# Altium project Sidekick Carrier - Rev. 1.PrjPcb (part 6 of 6)

## Sheet 15 USB.SchDoc
size B; DocumentNumber: 15; SheetNumber: 15; SheetTotal: 17
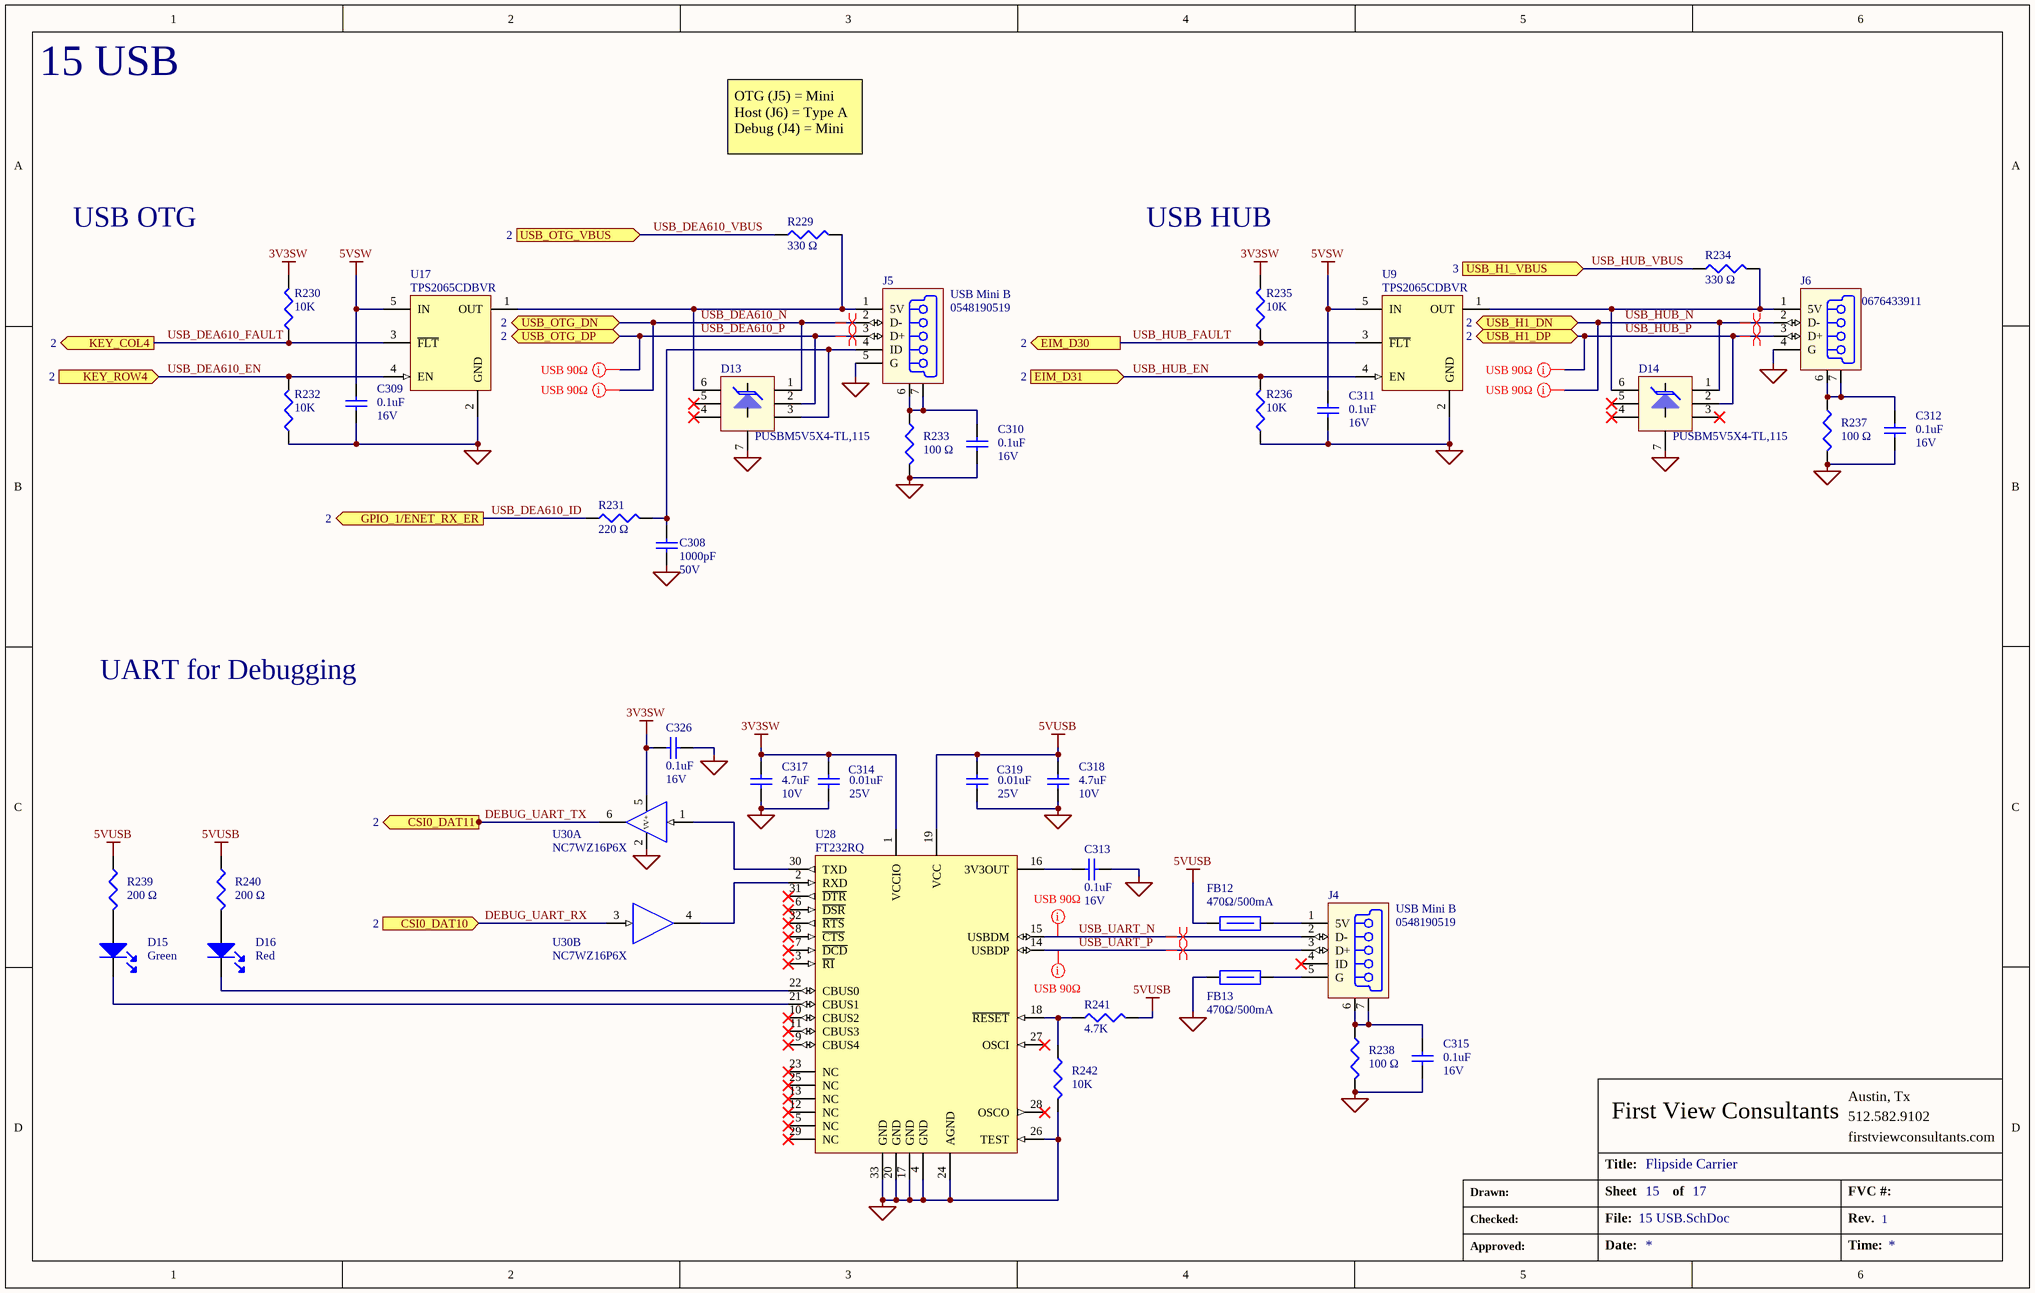
[diagram p14: 15 USB.SchDoc]

### Parts
C308  value 1000pF  Voltage: 50V  [CAP_0402]  (hidden comment: Cap 1000pF 50V 0402)
C309  value 0.1uF  Voltage: 16V  [CAP_0402]  (hidden comment: Cap 0.1uF 16V 0402)
C310  value 0.1uF  Voltage: 16V  [CAP_0402]  (hidden comment: Cap 0.1uF 16V 0402)
C311  value 0.1uF  Voltage: 16V  [CAP_0402]  (hidden comment: Cap 0.1uF 16V 0402)
C312  value 0.1uF  Voltage: 16V  [CAP_0402]  (hidden comment: Cap 0.1uF 16V 0402)
C313  value 0.1uF  Voltage: 16V  [CAP_0402]  (hidden comment: Cap 0.1uF 16V 0402)
C314  value 0.01uF  Voltage: 25V  [CAP_0402]  (hidden comment: Cap 0.01uF 50V 0402)
C315  value 0.1uF  Voltage: 16V  [CAP_0402]  (hidden comment: Cap 0.1uF 16V 0402)
C317  value 4.7uF  Voltage: 10V  [CAP_0402]  (hidden comment: Cap 4.7uF 10V 0603)
C318  value 4.7uF  Voltage: 10V  [CAP_0402]  (hidden comment: Cap 4.7uF 10V 0603)
C319  value 0.01uF  Voltage: 25V  [CAP_0402]  (hidden comment: Cap 0.01uF 50V 0402)
C326  value 0.1uF  Voltage: 16V  [CAP_0402]  (hidden comment: Cap 0.1uF 16V 0402)
D13  PUSBM5V5X4-TL,115  [DFN_PUSBM5V5X4-TL,115]
D14  PUSBM5V5X4-TL,115  [DFN_PUSBM5V5X4-TL,115]
D15  value Green  [LED_0603]  (hidden comment: LG L29K-G2J1-24-Z)
D16  value Red  [LED_0603]  (hidden comment: LTST-C191KRKT)
FB12  value 470Ω/500mA  [IND_0603]  (hidden comment: BLM18EG471SN1D)
FB13  value 470Ω/500mA  [IND_0603]  (hidden comment: BLM18EG471SN1D)
J4  0548190519  value USB Mini B  [CON_USB_0548190519]
J5  0548190519  value USB Mini B  [CON_USB_0548190519]
J6  0676433911  [CON_USB-0676433911]
R229  value 330 Ω  [RES_0402]  (hidden comment: Res 330R 0.063W)
R230  value 10K  [RES_0402]  (hidden comment: Res 10K 0.063W)
R231  value 220 Ω  [RES_0402]  (hidden comment: Res 220R 0.063W)
R232  value 10K  [RES_0402]  (hidden comment: Res 10K 0.063W)
R233  value 100 Ω  [RES_0402]  (hidden comment: Res 100R 0.063W)
R234  value 330 Ω  [RES_0402]  (hidden comment: Res 330R 0.063W)
R235  value 10K  [RES_0402]  (hidden comment: Res 10K 0.063W)
R236  value 10K  [RES_0402]  (hidden comment: Res 10K 0.063W)
R237  value 100 Ω  [RES_0402]  (hidden comment: Res 100R 0.063W)
R238  value 100 Ω  [RES_0402]  (hidden comment: Res 100R 0.063W)
R239  value 200 Ω  [RES_0402]  (hidden comment: Res 200R 0.063W)
R240  value 200 Ω  [RES_0402]  (hidden comment: Res 200R 0.063W)
R241  value 4.7K  [RES_0402]  (hidden comment: Res 4.7K 0.063W)
R242  value 10K  [RES_0402]  (hidden comment: Res 10K 0.063W)
U9  TPS2065CDBVR  [SOT-23-5_TPS2065CDBVR]
U17  TPS2065CDBVR  [SOT-23-5_TPS2065CDBVR]
U28  FT232RQ  [VFQFN-32_FT232RQ]
U30  NC7WZ16P6X  [SOT-363_NC7WZ16P6X]  (parts A,B of 2)

### Ports
CSI0_DAT10 (in, see 2), CSI0_DAT11 (out, see 2), EIM_D30 (out, see 2), EIM_D31 (in, see 2), GPIO_1/ENET_RX_ER (out, see 2), KEY_COL4 (out, see 2), KEY_ROW4 (in, see 2), USB_H1_DN (bidir, see 2), USB_H1_DP (bidir, see 2), USB_H1_VBUS (in, see 3), USB_OTG_DN (bidir, see 2), USB_OTG_DP (bidir, see 2), USB_OTG_VBUS (in, see 2)

### Nets
3V3SW: C314.1 C317.1 C326.1 R230.1 R235.1 U28.1(VCCIO) U30.5(V+)
5VSW: C309.1 C311.1 U9.5(IN) U17.5(IN)
5VUSB: C318.1 C319.1 FB12.1 R239.1 R240.1 R241.2 U28.19(VCC)
GND: C308.2 C309.2 C310.2 C311.2 C312.2 C313.2 C314.2 C315.2 C317.2 C318.2 C319.2 C326.2 D13.7 D14.7 FB13.1 J5.5(G) J6.4(G) R232.2 R233.2 R236.2 R237.2 R238.2 R242.2 U9.2(GND) U17.2(GND) U28.4(GND) U28.17(GND) U28.20(GND) U28.24(AGND) U28.26(TEST) U28.33(GND) U30.2(V-)
DEBUG_UART_RX: U30.3(A2) ; port CSI0_DAT10
DEBUG_UART_TX: U30.6(Y1) ; port CSI0_DAT11
USB_DEA610_EN: R232.1 U17.4(EN) ; port KEY_ROW4
USB_DEA610_FAULT: R230.2 U17.3(~{FLT}) ; port KEY_COL4
USB_DEA610_ID: R231.1 ; port GPIO_1/ENET_RX_ER
USB_DEA610_N: D13.1 J5.2(D-) ; port USB_OTG_DN
USB_DEA610_P: D13.2 J5.3(D+) ; port USB_OTG_DP
USB_DEA610_VBUS: R229.1 ; port USB_OTG_VBUS
USB_HUB_EN: R236.1 U9.4(EN) ; port EIM_D31
USB_HUB_FAULT: R235.2 U9.3(~{FLT}) ; port EIM_D30
USB_HUB_N: D14.1 J6.2(D-) ; port USB_H1_DN
USB_HUB_P: D14.2 J6.3(D+) ; port USB_H1_DP
USB_HUB_VBUS: R234.1 ; port USB_H1_VBUS
USB_UART_N: J4.2(D-) U28.15(USBDM)
USB_UART_P: J4.3(D+) U28.14(USBDP)
NetC308_1: C308.1 D13.3 J5.4(ID) R231.2
NetC310_1: C310.1 J5.6(S1) J5.7(S2) R233.1
NetC312_1: C312.1 J6.6(S1) J6.7(S2) R237.1
NetC313_1: C313.1 U28.16(3V3OUT)
NetC315_1: C315.1 J4.6(S1) J4.7(S2) R238.1
NetD13_6: D13.6 J5.1(5V) R229.2 U17.1(OUT)
NetD14_6: D14.6 J6.1(5V) R234.2 U9.1(OUT)
NetD15_A: D15.A R239.2
NetD15_K: D15.K U28.21(CBUS1)
NetD16_A: D16.A R240.2
NetD16_K: D16.K U28.22(CBUS0)
NetFB12_2: FB12.2 J4.1(5V)
NetFB13_2: FB13.2 J4.5(G)
NetR241_1: R241.1 R242.1 U28.18(~{RESET})
NetU28_2: U28.2(RXD) U30.4(Y2)
NetU28_30: U28.30(TXD) U30.1(A1)

Not connected (* = marked no-connect by the designer): D13 4* 5*; D14 3* 4* 5*; J4 4(ID)*; U28 3(~{RI})* 5(NC)* 6(~{DSR})* 7(~{DCD})* 8(~{CTS})* 9(CBUS4)* 10(CBUS2)* 11(CBUS3)* 12(NC)* 13(NC)* 23(NC)* 25(NC)* 27(OSCI)* 28(OSCO)* 29(NC)* 31(~{DTR})* 32(~{RTS})*

### Layout directives
net class USB 90ohm; Impedance: 90 Ω: USB_DEA610_N, USB_DEA610_P, USB_HUB_N, USB_HUB_P, USB_UART_N, USB_UART_P
differential pair: USB_DEA610_N, USB_DEA610_P, USB_HUB_N, USB_HUB_P, USB_UART_N, USB_UART_P

### Notes on the sheet
- 15 USB
- OTG (J5) = Mini
  Host (J6) = Type A
  Debug (J4) = Mini
- USB OTG
- USB HUB
- UART for Debugging
- Austin, Tx
- Title:
- First View Consultants
- 512.582.9102
- firstviewconsultants.com
- Drawn:
- Checked:
- File:
- Sheet
- of
- FVC #:
- Rev.
- Approved:
- Date:
- Time:

### Library data of the parts
C308 = Cap 1000pF 50V 0402: Cap, Cer, 1000pF, 50V, 20%, X7R, 0402; Manufacturer: Murata Electronics North America; Manufacturer #: GRM155R71H102KA01D; Have Footprint: yes; Tolerance: 20%; PACKAGE: 0402
C309-C313 C315 C326 = Cap 0.1uF 16V 0402: Cap, Cer, 0.1uF, 16V, 10%, X7R, 0402; Manufacturer #: GRM155R71C104KA88D; Manufacturer: Murata Electronics North America; Have Footprint: yes; Package: 0402; Tolerance: ±10%
C314 C319 = Cap 0.01uF 50V 0402: Cap, Cer, 0.01uF, 25V, ±10%, X7R, 0402; Manufacturer #: GRM155R71E103KA01J; Manufacturer: Murata; Have Footprint: yes; Tolerance: ±10%; Package: 0402
C317 C318 = Cap 4.7uF 10V 0603: Cap, Cer, 4.7uF, 10V, 10%, X5R, 0603; Manufacturer #: LMK107BJ475KA-T; Manufacturer: Taiyo Yuden; Have Footprint: yes; Tolerance: ±10%; Package: 0402
D13 D14 = PUSBM5V5X4-TL,115: Diode, TVS, USB 2.0 & OTG, DFN-6; Manufacturer: NXP Semiconductors; Package: DFN (1.6x1.6); Manufacturer #: PUSBM5V5X4-TL,115
D15 = LG L29K-G2J1-24-Z: Led, Green, 2mA, 1.7V, 0603; Manufacturer: OSRAM Opto Semiconductors Inc; Have Footprint: yes; RoHS: yes; Operating Temperature: -40°C ~ 125°C; Package: 0603; Manufacturer #: LG L29K-G2J1-24-Z
D16 = LTST-C191KRKT: Led, Red, 20mA, 2V, 0603; Manufacturer: Lite-On Inc; Have Footprint: yes; RoHS: yes; Package: 0603; Manufacturer #: LTST-C191KRKT
FB12 FB13 = BLM18EG471SN1D: Ind, Ferrite Bead, 470R, 210mOhm, 0.5A, 0603; Manufacturer: Murata Electronics North America; Have Footprint: yes; Manufacturer #: BLM18EG471SN1D; Cost: 0.23; Package: 0603
J4 J5 = 0548190519: Conn, USB, Mini B, 5 Pos, R/A, TH; Manufacturer: Molex Inc; Manufacturer #: 0548190519
J6 = 0676433911: Conn, USB, Type A, 4 Pos, R/A, TH; Manufacturer: Molex Inc; Manufacturer #: 0676433911
R229 R234 = Res 330R 0.063W: Res, 330R, 0.063W, 1%, 0402; Manufacturer #: RC0402FR-07330RL; Manufacturer: Yageo; Have Footprint: yes; Package: 0402; Cost: *
R230 R232 R235 R236 R242 = Res 10K 0.063W: Res, 10K, 1/16W, 1%, 0402; Manufacturer #: RC0402FR-0710KL; Manufacturer: Yageo; Have Footprint: yes; Package: 0402
R231 = Res 220R 0.063W: Res, 220R, 0.063W, 5%, 0402; Manufacturer #: RMCF0402JT220R; Manufacturer: Stackpole Electronics Inc; Have Footprint: yes; Package: 0402
R233 R237 R238 = Res 100R 0.063W: Res, 100R, 0.063W, 1%, 0402; Manufacturer #: TRR01MZPF1000; Manufacturer: Murata Electronics North America; Have Footprint: yes; Package: 0402
R239 R240 = Res 200R 0.063W: Res, 200R, 0.063W, 1%, 0402; Manufacturer #: RC0402FR-07200RL; Manufacturer: Yageo; Have Footprint: yes; Package: 0402
R241 = Res 4.7K 0.063W: Res, 4.70K, 0.063W, 1%, 0402; Manufacturer #: CRCW04024K70FKED; Manufacturer: Vishay Dale; Have Footprint: yes; Package: 0402
U9 U17 = TPS2065CDBVR: IC, Power Switch, USB, 1.48A, SOT-23-5; Manufacturer: Texas Instruments; θJA: 224.9; Have Footprint: yes; Package: SOT-23-5; Operating Temperature: -40°C ~ 85°C; RoHS: yes; Manufacturer #: TPS2065CDBVR
U28 = FT232RQ: IC, USB to UART, 3.3-5.25V, QFN-32; Manufacturer #: FT232RQ-REEL; Manufacturer: FTDI; Have Footprint: yes
U30 = NC7WZ16P6X: IC, Buffer, 1.65-5.5V, -40+125°C, SOT-363; Manufacturer: Fairchild Semiconductor; Have Footprint: yes; Cost: 0.45; Package: SOT-363; Manufacturer #: NC7WZ16P6X

## Sheet 16 Ethernet.SchDoc
size B; DocumentNumber: 16; SheetNumber: 16; SheetTotal: 17
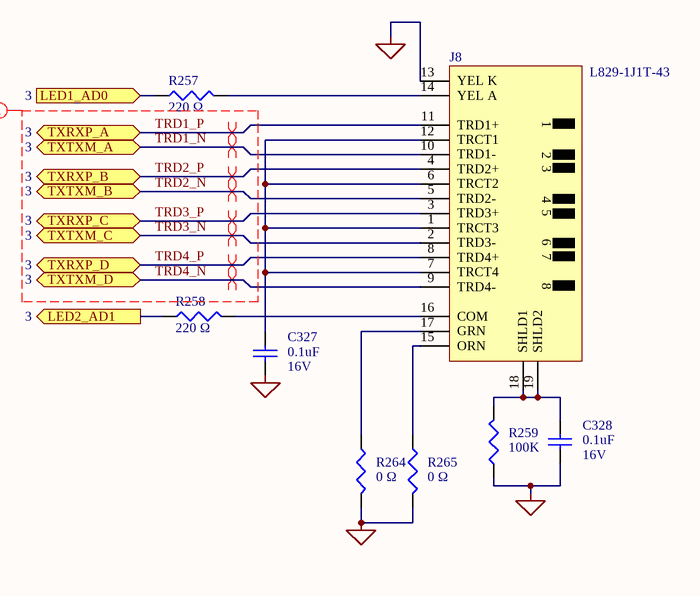
[diagram p15: 16 Ethernet.SchDoc]

### Parts
C327  value 0.1uF  Voltage: 16V  [CAP_0402]  (hidden comment: Cap 0.1uF 16V 0402)
C328  value 0.1uF  Voltage: 16V  [CAP_0402]  (hidden comment: Cap 0.1uF 16V 0402)
J8  L829-1J1T-43  [CON_Ethernet_L829-1J1T-43]
R257  value 220 Ω  [RES_0402]  (hidden comment: Res 220R 0.063W)
R258  value 220 Ω  [RES_0402]  (hidden comment: Res 220R 0.063W)
R259  value 100K  [RES_0402]  (hidden comment: Res 100K 0.1W)
R264  value 0 Ω  [RES_0402]  (hidden comment: Res 0 ohm 0.1W)
R265  value 0 Ω  [RES_0402]  (hidden comment: Res 0 ohm 0.1W)

### Ports
LED1_AD0 (in, see 3), LED2_AD1 (out, see 3), TXRXP_A (bidir, see 3), TXRXP_B (bidir, see 3), TXRXP_C (bidir, see 3), TXRXP_D (bidir, see 3), TXTXM_A (bidir, see 3), TXTXM_B (bidir, see 3), TXTXM_C (bidir, see 3), TXTXM_D (bidir, see 3)

### Nets
GND: C327.2 C328.2 J8.13(YEL_K) R259.1 R264.2 R265.2
TRD1_N: J8.10(TRD1-) ; port TXTXM_A
TRD1_P: J8.11(TRD1+) ; port TXRXP_A
TRD2_N: J8.5(TRD2-) ; port TXTXM_B
TRD2_P: J8.4(TRD2+) ; port TXRXP_B
TRD3_N: J8.2(TRD3-) ; port TXTXM_C
TRD3_P: J8.3(TRD3+) ; port TXRXP_C
TRD4_N: J8.9(TRD4-) ; port TXTXM_D
TRD4_P: J8.8(TRD4+) ; port TXRXP_D
NetC327_1: C327.1 J8.1(TRCT3) J8.6(TRCT2) J8.7(TRCT4) J8.12(TRCT1)
NetC328_1: C328.1 J8.18(SHLD1) J8.19(SHLD2) R259.2
NetJ7_258: R257.1 ; port LED1_AD0
NetJ7_260: R258.1 ; port LED2_AD1
NetJ8_14: J8.14(YEL_A) R257.2
NetJ8_15: J8.15(ORN) R265.1
NetJ8_16: J8.16(COM) R258.2
NetJ8_17: J8.17(GRN) R264.1

### Layout directives
net class ETHERNET 100ohm: TRD1_N, TRD1_P, TRD2_N, TRD2_P, TRD3_N, TRD3_P, TRD4_N, TRD4_P
differential pair: TRD1_N, TRD1_P, TRD2_N, TRD2_P, TRD3_N, TRD3_P, TRD4_N, TRD4_P

### Notes on the sheet
- Austin, Tx
- Title:
- First View Consultants
- 512.582.9102
- firstviewconsultants.com
- Drawn:
- Checked:
- File:
- Sheet
- of
- FVC #:
- Rev.
- Approved:
- Date:
- Time:

### Library data of the parts
C327 C328 = Cap 0.1uF 16V 0402: as C309-C313 on sheet 15 USB; Package: 0402; Tolerance: ±10%
J8 = L829-1J1T-43: Conn, Ethernet, 10/100/1000,G Base-T, TH; Manufacturer: Bel Fuse Inc; Manufacturer #: L829-1J1T-43
R257 R258 = Res 220R 0.063W: as R231 on sheet 15 USB; Package: 0402
R259 = Res 100K 0.1W: Res, 100K, 0.1W, 1%, 0402; Manufacturer #: ERJ-2RKF1003X; Manufacturer: Panasonic Electronic Components; Have Footprint: yes; Package: 0402
R264 R265 = Res 0 ohm 0.1W: Res, 0 ohm, 1/16W, 0402; Manufacturer #: CRCW04020000Z0ED; Manufacturer: Vishay Dale; Have Footprint: yes; Package: 0402

## Sheet 17 USB 3.0.SchDoc
size C; DocumentNumber: 17; SheetNumber: 17; SheetTotal: 17; PageSetup: Record=PageOptions|CenterHorizontal=True|CenterVertical=True|PrintScale=0.70|XCorrection=1.00|YCorrection=1.00|PrintKind=1|BorderSize=5000000|LeftOffset=0|BottomOffset=0|Orientation=2|PaperLength=1000|PaperWidth=1000|Scale=100|PaperSource=7|PrintQuality=600|MediaType=1|DitherType=10|PrintScaleMode=1|PaperKind=11x17|PaperIndex=17
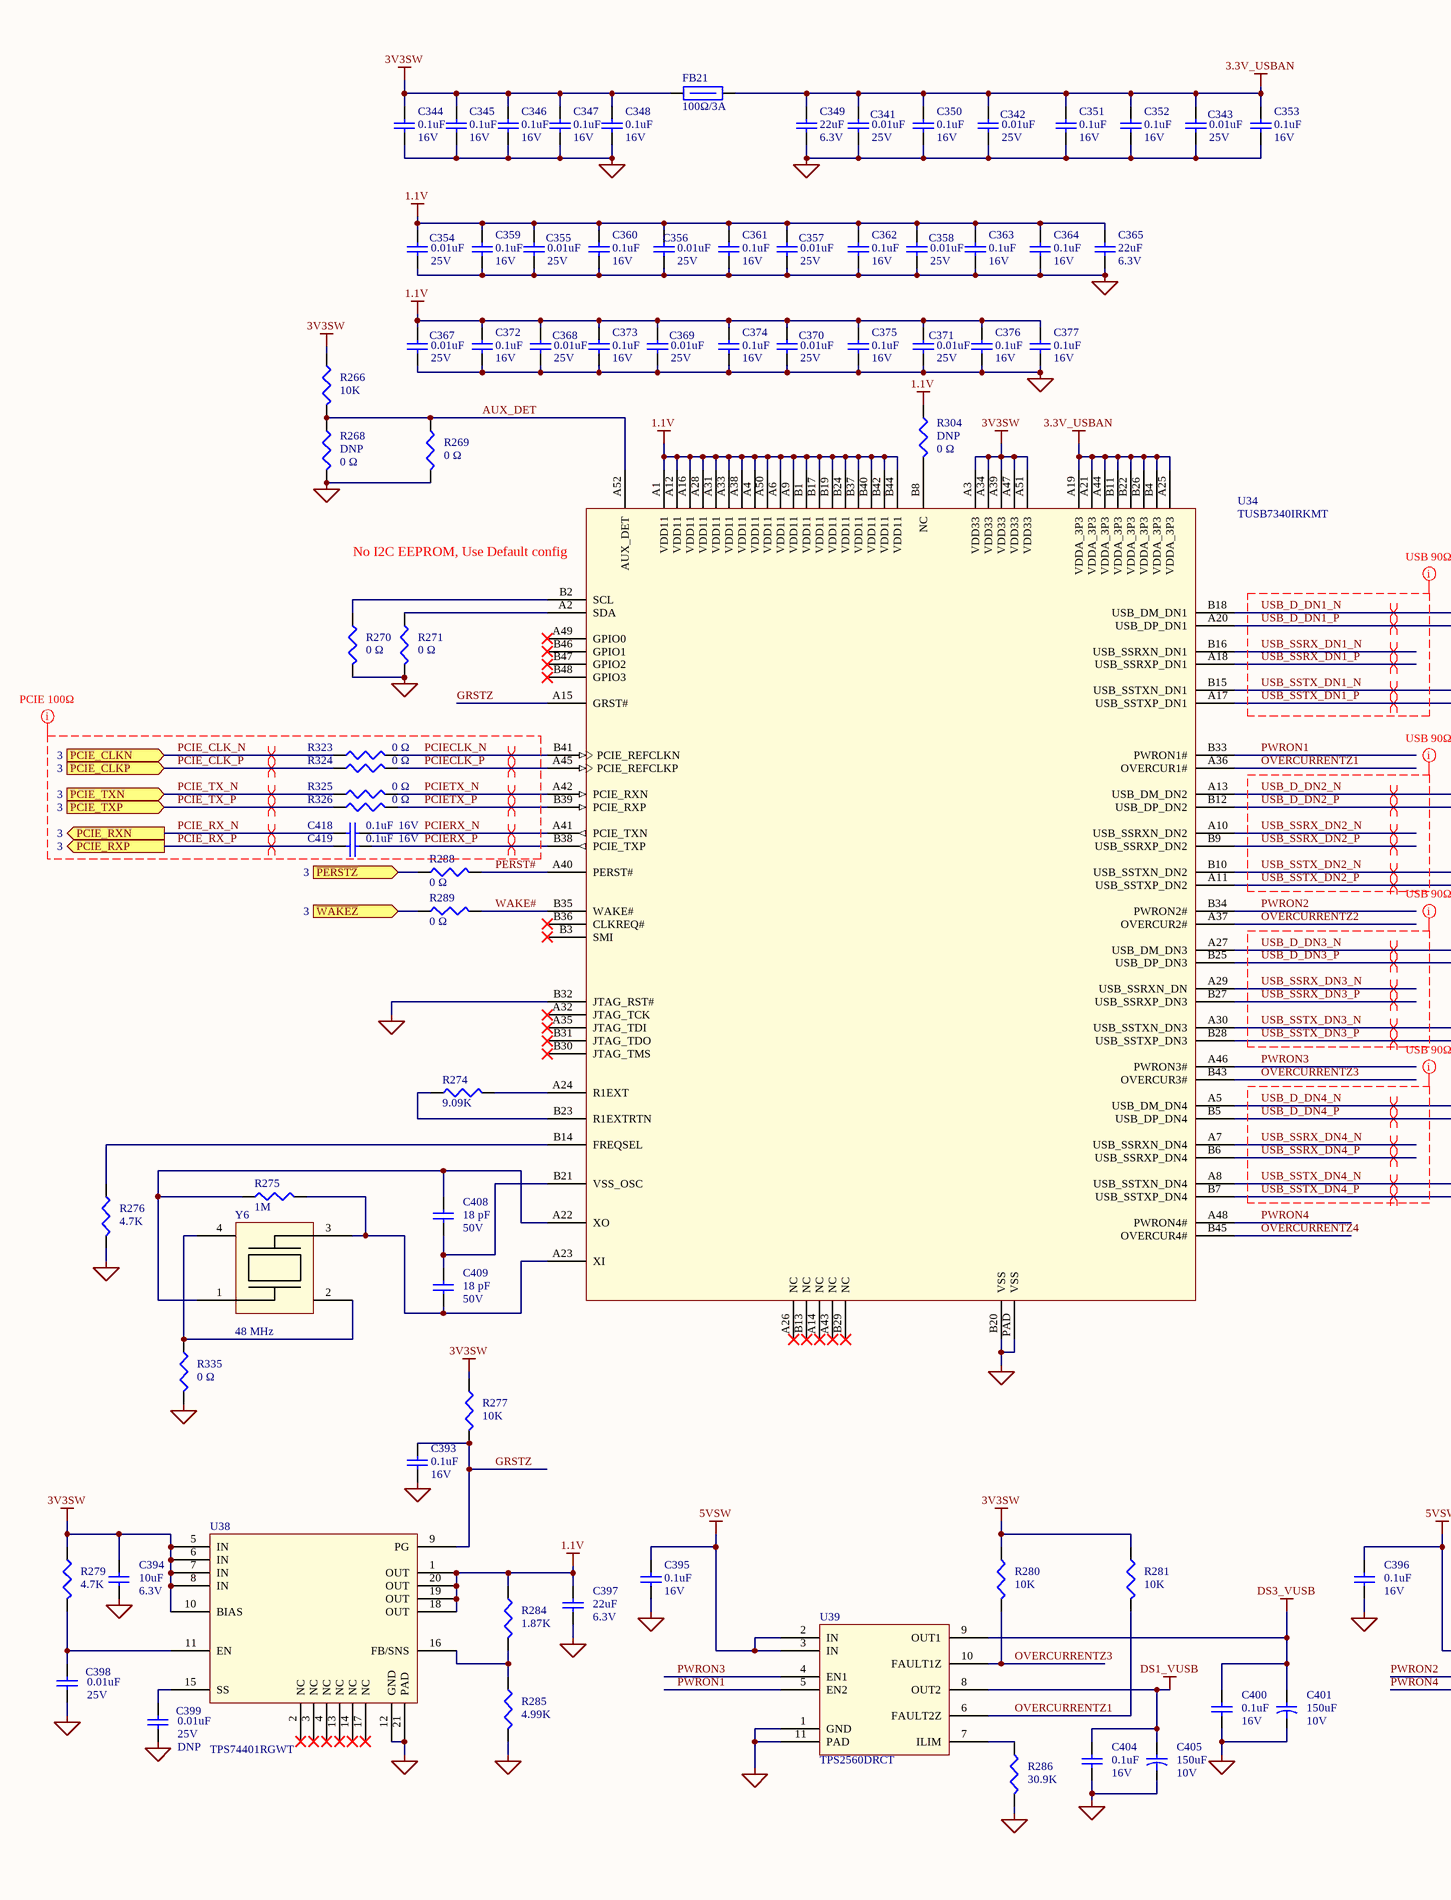
[diagram p16: 17 USB 3.0.SchDoc, left]
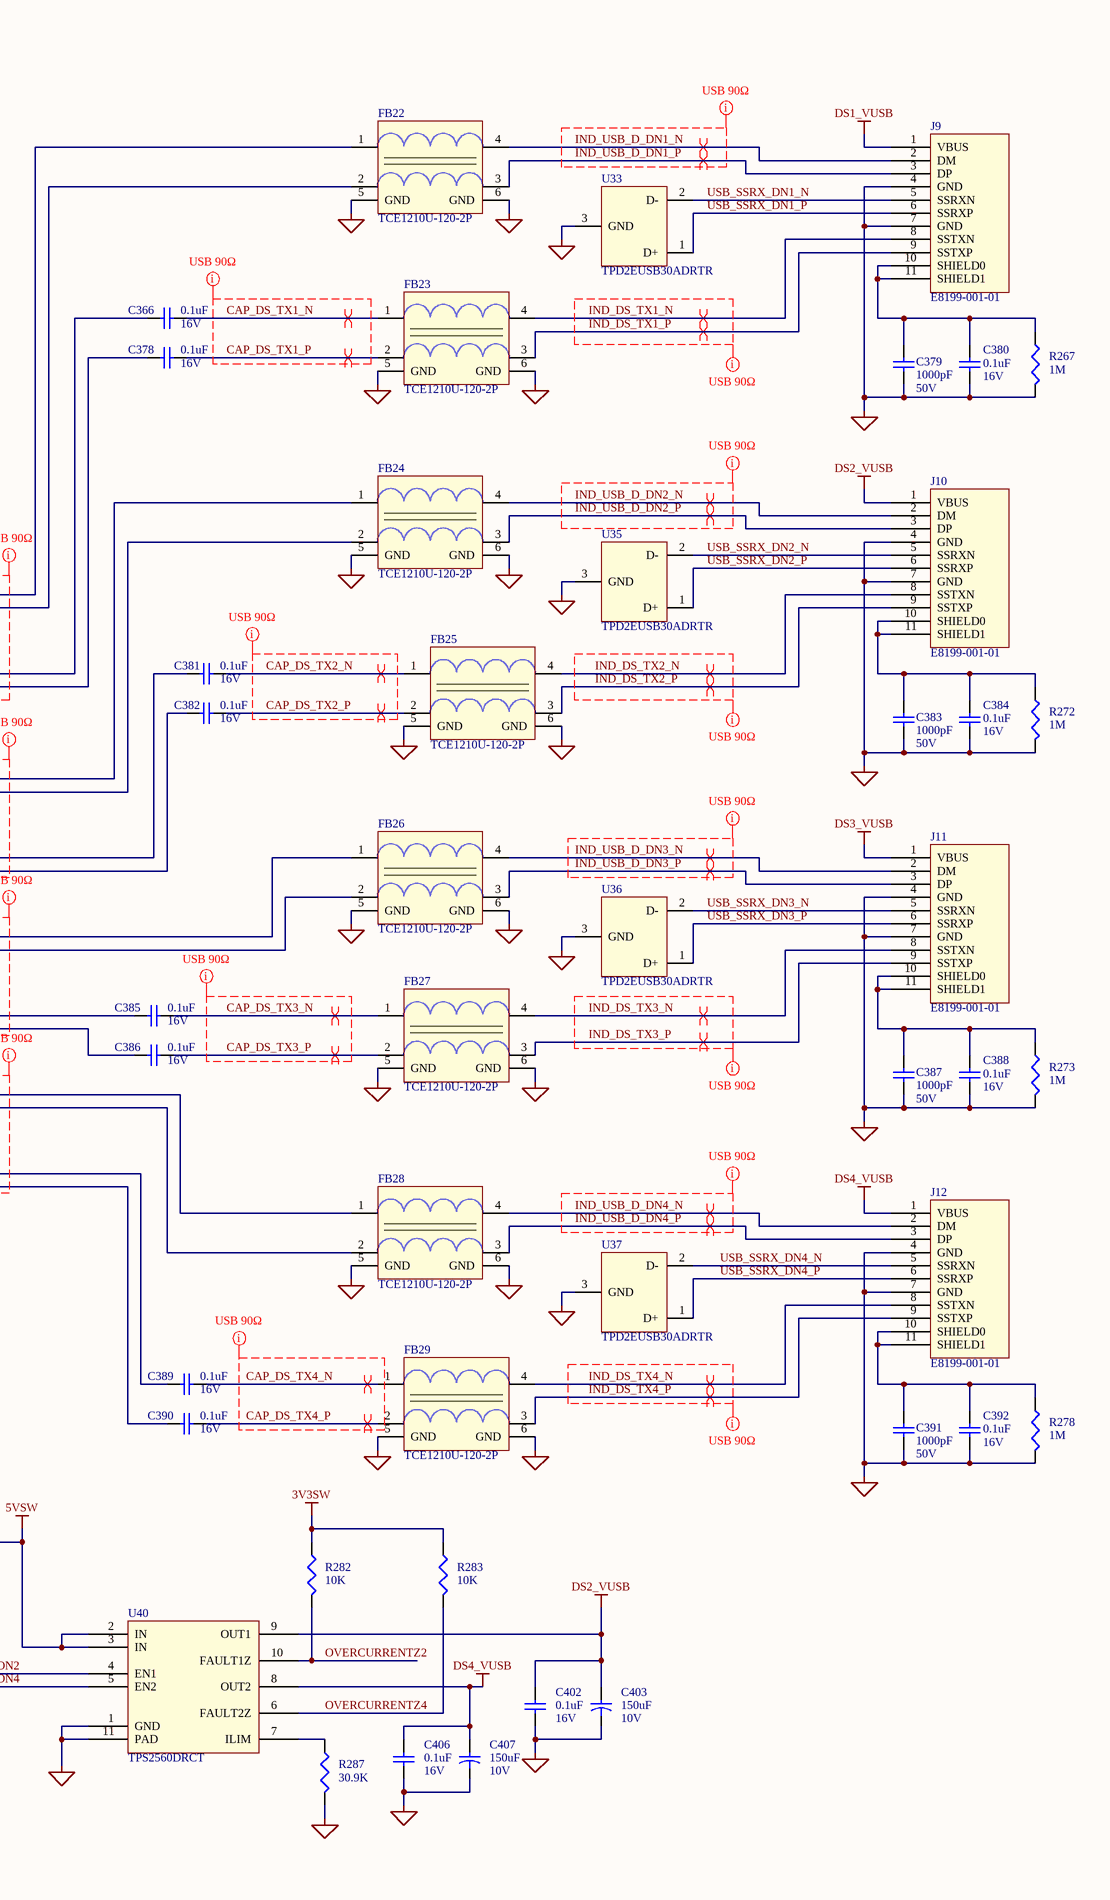
[diagram p17: 17 USB 3.0.SchDoc, right]

### Parts
C341  value 0.01uF  Voltage: 25V  [CAP_0402]  (hidden comment: Cap 0.01uF 50V 0402)
C342  value 0.01uF  Voltage: 25V  [CAP_0402]  (hidden comment: Cap 0.01uF 50V 0402)
C343  value 0.01uF  Voltage: 25V  [CAP_0402]  (hidden comment: Cap 0.01uF 50V 0402)
C344  value 0.1uF  Voltage: 16V  [CAP_0402]  (hidden comment: Cap 0.1uF 16V 0402)
C345  value 0.1uF  Voltage: 16V  [CAP_0402]  (hidden comment: Cap 0.1uF 16V 0402)
C346  value 0.1uF  Voltage: 16V  [CAP_0402]  (hidden comment: Cap 0.1uF 16V 0402)
C347  value 0.1uF  Voltage: 16V  [CAP_0402]  (hidden comment: Cap 0.1uF 16V 0402)
C348  value 0.1uF  Voltage: 16V  [CAP_0402]  (hidden comment: Cap 0.1uF 16V 0402)
C349  value 22uF  Voltage: 6.3V  [CAP_0603]  (hidden comment: Cap 22uF 6.3V 0603)
C350  value 0.1uF  Voltage: 16V  [CAP_0402]  (hidden comment: Cap 0.1uF 16V 0402)
C351  value 0.1uF  Voltage: 16V  [CAP_0402]  (hidden comment: Cap 0.1uF 16V 0402)
C352  value 0.1uF  Voltage: 16V  [CAP_0402]  (hidden comment: Cap 0.1uF 16V 0402)
C353  value 0.1uF  Voltage: 16V  [CAP_0402]  (hidden comment: Cap 0.1uF 16V 0402)
C354  value 0.01uF  Voltage: 25V  [CAP_0402]  (hidden comment: Cap 0.01uF 50V 0402)
C355  value 0.01uF  Voltage: 25V  [CAP_0402]  (hidden comment: Cap 0.01uF 50V 0402)
C356  value 0.01uF  Voltage: 25V  [CAP_0402]  (hidden comment: Cap 0.01uF 50V 0402)
C357  value 0.01uF  Voltage: 25V  [CAP_0402]  (hidden comment: Cap 0.01uF 50V 0402)
C358  value 0.01uF  Voltage: 25V  [CAP_0402]  (hidden comment: Cap 0.01uF 50V 0402)
C359  value 0.1uF  Voltage: 16V  [CAP_0402]  (hidden comment: Cap 0.1uF 16V 0402)
C360  value 0.1uF  Voltage: 16V  [CAP_0402]  (hidden comment: Cap 0.1uF 16V 0402)
C361  value 0.1uF  Voltage: 16V  [CAP_0402]  (hidden comment: Cap 0.1uF 16V 0402)
C362  value 0.1uF  Voltage: 16V  [CAP_0402]  (hidden comment: Cap 0.1uF 16V 0402)
C363  value 0.1uF  Voltage: 16V  [CAP_0402]  (hidden comment: Cap 0.1uF 16V 0402)
C364  value 0.1uF  Voltage: 16V  [CAP_0402]  (hidden comment: Cap 0.1uF 16V 0402)
C365  value 22uF  Voltage: 6.3V  [CAP_0603]  (hidden comment: Cap 22uF 6.3V 0603)
C366  value 0.1uF  Voltage: 16V  [CAP_0402]  (hidden comment: Cap 0.1uF 16V 0402)
C367  value 0.01uF  Voltage: 25V  [CAP_0402]  (hidden comment: Cap 0.01uF 50V 0402)
C368  value 0.01uF  Voltage: 25V  [CAP_0402]  (hidden comment: Cap 0.01uF 50V 0402)
C369  value 0.01uF  Voltage: 25V  [CAP_0402]  (hidden comment: Cap 0.01uF 50V 0402)
C370  value 0.01uF  Voltage: 25V  [CAP_0402]  (hidden comment: Cap 0.01uF 50V 0402)
C371  value 0.01uF  Voltage: 25V  [CAP_0402]  (hidden comment: Cap 0.01uF 50V 0402)
C372  value 0.1uF  Voltage: 16V  [CAP_0402]  (hidden comment: Cap 0.1uF 16V 0402)
C373  value 0.1uF  Voltage: 16V  [CAP_0402]  (hidden comment: Cap 0.1uF 16V 0402)
C374  value 0.1uF  Voltage: 16V  [CAP_0402]  (hidden comment: Cap 0.1uF 16V 0402)
C375  value 0.1uF  Voltage: 16V  [CAP_0402]  (hidden comment: Cap 0.1uF 16V 0402)
C376  value 0.1uF  Voltage: 16V  [CAP_0402]  (hidden comment: Cap 0.1uF 16V 0402)
C377  value 0.1uF  Voltage: 16V  [CAP_0402]  (hidden comment: Cap 0.1uF 16V 0402)
C378  value 0.1uF  Voltage: 16V  [CAP_0402]  (hidden comment: Cap 0.1uF 16V 0402)
C379  value 1000pF  Voltage: 50V  [CAP_0402]  (hidden comment: Cap 1000pF 50V 0402)
C380  value 0.1uF  Voltage: 16V  [CAP_0402]  (hidden comment: Cap 0.1uF 16V 0402)
C381  value 0.1uF  Voltage: 16V  [CAP_0402]  (hidden comment: Cap 0.1uF 16V 0402)
C382  value 0.1uF  Voltage: 16V  [CAP_0402]  (hidden comment: Cap 0.1uF 16V 0402)
C383  value 1000pF  Voltage: 50V  [CAP_0402]  (hidden comment: Cap 1000pF 50V 0402)
C384  value 0.1uF  Voltage: 16V  [CAP_0402]  (hidden comment: Cap 0.1uF 16V 0402)
C385  value 0.1uF  Voltage: 16V  [CAP_0402]  (hidden comment: Cap 0.1uF 16V 0402)
C386  value 0.1uF  Voltage: 16V  [CAP_0402]  (hidden comment: Cap 0.1uF 16V 0402)
C387  value 1000pF  Voltage: 50V  [CAP_0402]  (hidden comment: Cap 1000pF 50V 0402)
C388  value 0.1uF  Voltage: 16V  [CAP_0402]  (hidden comment: Cap 0.1uF 16V 0402)
C389  value 0.1uF  Voltage: 16V  [CAP_0402]  (hidden comment: Cap 0.1uF 16V 0402)
C390  value 0.1uF  Voltage: 16V  [CAP_0402]  (hidden comment: Cap 0.1uF 16V 0402)
C391  value 1000pF  Voltage: 50V  [CAP_0402]  (hidden comment: Cap 1000pF 50V 0402)
C392  value 0.1uF  Voltage: 16V  [CAP_0402]  (hidden comment: Cap 0.1uF 16V 0402)
C393  value 0.1uF  Voltage: 16V  [CAP_0402]  (hidden comment: Cap 0.1uF 16V 0402)
C394  value 10uF  Voltage: 6.3V  [CAP_0402]  (hidden comment: Cap 10uF 6.3V 0402)
C395  value 0.1uF  Voltage: 16V  [CAP_0402]  (hidden comment: Cap 0.1uF 16V 0402)
C396  value 0.1uF  Voltage: 16V  [CAP_0402]  (hidden comment: Cap 0.1uF 16V 0402)
C397  value 22uF  Voltage: 6.3V  [CAP_0603]  (hidden comment: Cap 22uF 6.3V 0603)
C398  value 0.01uF  Voltage: 25V  [CAP_0402]  (hidden comment: Cap 0.01uF 50V 0402)
C399  value 0.01uF  Voltage: 25V  [CAP_0402]  (hidden comment: Cap 0.01uF 50V 0402)
C400  value 0.1uF  Voltage: 16V  [CAP_0402]  (hidden comment: Cap 0.1uF 16V 0402)
C401  value 150uF  Voltage: 10V  [SMD(6.6x6.6x5.8)_WT1A151MCL1GS]  (hidden comment: Cap 150uF 10V)
C402  value 0.1uF  Voltage: 16V  [CAP_0402]  (hidden comment: Cap 0.1uF 16V 0402)
C403  value 150uF  Voltage: 10V  [SMD(6.6x6.6x5.8)_WT1A151MCL1GS]  (hidden comment: Cap 150uF 10V)
C404  value 0.1uF  Voltage: 16V  [CAP_0402]  (hidden comment: Cap 0.1uF 16V 0402)
C405  value 150uF  Voltage: 10V  [SMD(6.6x6.6x5.8)_WT1A151MCL1GS]  (hidden comment: Cap 150uF 10V)
C406  value 0.1uF  Voltage: 16V  [CAP_0402]  (hidden comment: Cap 0.1uF 16V 0402)
C407  value 150uF  Voltage: 10V  [SMD(6.6x6.6x5.8)_WT1A151MCL1GS]  (hidden comment: Cap 150uF 10V)
C408  value 18 pF  Voltage: 50V  [CAP_0402]  (hidden comment: Cap 18pF 50V 0402)
C409  value 18 pF  Voltage: 50V  [CAP_0402]  (hidden comment: Cap 18pF 50V 0402)
C418  value 0.1uF  Voltage: 16V  [CAP_0402]  (hidden comment: Cap 0.1uF 16V 0402)
C419  value 0.1uF  Voltage: 16V  [CAP_0402]  (hidden comment: Cap 0.1uF 16V 0402)
FB21  value 100Ω/3A  [IND_0603]  (hidden comment: BLM18KG101TN1D)
FB22  TCE1210U-120-2P  [USB_TCE1210U-120-2P]
FB23  TCE1210U-120-2P  [USB_TCE1210U-120-2P]
FB24  TCE1210U-120-2P  [USB_TCE1210U-120-2P]
FB25  TCE1210U-120-2P  [USB_TCE1210U-120-2P]
FB26  TCE1210U-120-2P  [USB_TCE1210U-120-2P]
FB27  TCE1210U-120-2P  [USB_TCE1210U-120-2P]
FB28  TCE1210U-120-2P  [USB_TCE1210U-120-2P]
FB29  TCE1210U-120-2P  [USB_TCE1210U-120-2P]
J9  E8199-001-01  [USB_E8199-001-01]
J10  E8199-001-01  [USB_E8199-001-01]
J11  E8199-001-01  [USB_E8199-001-01]
J12  E8199-001-01  [USB_E8199-001-01]
R266  value 10K  [RES_0402]  (hidden comment: Res 10K 0.063W)
R267  value 1M  [RES_0402]  (hidden comment: Res 1M 0.063W)
R268  value 0 Ω  [RES_0402]  (hidden comment: Res 0 ohm 0.1W DNP)
R269  value 0 Ω  [RES_0402]  (hidden comment: Res 0 ohm 0.1W)
R270  value 0 Ω  [RES_0402]  (hidden comment: Res 0 ohm 0.1W)
R271  value 0 Ω  [RES_0402]  (hidden comment: Res 0 ohm 0.1W)
R272  value 1M  [RES_0402]  (hidden comment: Res 1M 0.063W)
R273  value 1M  [RES_0402]  (hidden comment: Res 1M 0.063W)
R274  value 9.09K  [RES_0402]  (hidden comment: Res 9.09K 0.063W)
R275  value 1M  [RES_0402]  (hidden comment: Res 1M 0.063W)
R276  value 4.7K  [RES_0402]  (hidden comment: Res 4.7K 0.063W)
R277  value 10K  [RES_0402]  (hidden comment: Res 10K 0.063W)
R278  value 1M  [RES_0402]  (hidden comment: Res 1M 0.063W)
R279  value 4.7K  [RES_0402]  (hidden comment: Res 4.7K 0.063W)
R280  value 10K  [RES_0402]  (hidden comment: Res 10K 0.063W)
R281  value 10K  [RES_0402]  (hidden comment: Res 10K 0.063W)
R282  value 10K  [RES_0402]  (hidden comment: Res 10K 0.063W)
R283  value 10K  [RES_0402]  (hidden comment: Res 10K 0.063W)
R284  value 1.87K  [RES_0402]  (hidden comment: Res 1.87K 0.063W)
R285  value 4.99K  [RES_0402]  (hidden comment: Res 4.99K 0.063W)
R286  value 30.9K  [RES_0402]  (hidden comment: Res 30.9K 0.063W)
R287  value 30.9K  [RES_0402]  (hidden comment: Res 30.9K 0.063W)
R288  value 0 Ω  [RES_0402]  (hidden comment: Res 0 ohm 0.1W)
R289  value 0 Ω  [RES_0402]  (hidden comment: Res 0 ohm 0.1W)
R304  value 0 Ω  [RES_0402]  (hidden comment: Res 0 ohm 0.1W DNP)
R323  value 0 Ω  [RES_0402]  (hidden comment: Res 0 ohm 0.1W)
R324  value 0 Ω  [RES_0402]  (hidden comment: Res 0 ohm 0.1W)
R325  value 0 Ω  [RES_0402]  (hidden comment: Res 0 ohm 0.1W)
R326  value 0 Ω  [RES_0402]  (hidden comment: Res 0 ohm 0.1W)
R335  value 0 Ω  [RES_0402]  (hidden comment: Res 0 ohm 0.1W)
U33  TPD2EUSB30ADRTR  [SOT-3_TPD2EUSB30ADRTR]
U34  TUSB7340IRKMT  [WQFN-100_TUSB7340]
U35  TPD2EUSB30ADRTR  [SOT-3_TPD2EUSB30ADRTR]
U36  TPD2EUSB30ADRTR  [SOT-3_TPD2EUSB30ADRTR]
U37  TPD2EUSB30ADRTR  [SOT-3_TPD2EUSB30ADRTR]
U38  TPS74401RGWT  [VQFN-20_TPS74401RGWT]
U39  TPS2560DRCT  [VSON-10_TPS2560DRCT]
U40  TPS2560DRCT  [VSON-10_TPS2560DRCT]
Y6  value 48 MHz  [SMD(5x3.2)_ABM3B-48.000MHZ-B2-T]  (hidden comment: ABM3B-48.000MHZ-B2-T)

### Ports
PCIE_CLKN (in, see 3), PCIE_CLKP (in, see 3), PCIE_RXN (out, see 3), PCIE_RXP (out, see 3), PCIE_TXN (in, see 3), PCIE_TXP (in, see 3), ~{PERSTZ} (in, see 3), ~{WAKEZ} (in, see 3)

### Nets
1.1V: C354.1 C355.1 C356.1 C357.1 C358.1 C359.1 C360.1 C361.1 C362.1 C363.1 C364.1 C365.1 C367.1 C368.1 C369.1 C370.1 C371.1 C372.1 C373.1 C374.1 C375.1 C376.1 C377.1 C397.1 R284.1 R304.1 U34.A1(VDD11) U34.A4(VDD11) U34.A6(VDD11) U34.A9(VDD11) U34.A12(VDD11) U34.A16(VDD11) U34.A28(VDD11) U34.A31(VDD11) U34.A33(VDD11) U34.A38(VDD11) U34.A50(VDD11) U34.B1(VDD11) U34.B17(VDD11) U34.B19(VDD11) U34.B24(VDD11) U34.B37(VDD11) U34.B40(VDD11) U34.B42(VDD11) U34.B44(VDD11) U38.1(OUT) U38.18(OUT) U38.19(OUT) U38.20(OUT)
3.3V_USBAN: C341.1 C342.1 C343.1 C349.1 C350.1 C351.1 C352.1 C353.1 FB21.2 U34.A19(VDDA_3P3) U34.A21(VDDA_3P3) U34.A25(VDDA_3P3) U34.A44(VDDA_3P3) U34.B4(VDDA_3P3) U34.B11(VDDA_3P3) U34.B22(VDDA_3P3) U34.B26(VDDA_3P3)
3V3SW: C344.1 C345.1 C346.1 C347.1 C348.1 C394.1 FB21.1 R266.1 R277.1 R279.1 R280.1 R281.1 R282.1 R283.1 U34.A3(VDD33) U34.A34(VDD33) U34.A39(VDD33) U34.A47(VDD33) U34.A51(VDD33) U38.5(IN) U38.6(IN) U38.7(IN) U38.8(IN) U38.10(BIAS)
5VSW: C395.1 C396.2 U39.2(IN) U39.3(IN) U40.2(IN) U40.3(IN)
DS1_VUSB: C404.1 C405.1 J9.1(VBUS) U39.8(OUT2)
DS2_VUSB: C402.1 C403.1 J10.1(VBUS) U40.9(OUT1)
DS3_VUSB: C400.1 C401.1 J11.1(VBUS) U39.9(OUT1)
DS4_VUSB: C406.1 C407.1 J12.1(VBUS) U40.8(OUT2)
GND: C341.2 C342.2 C343.2 C344.2 C345.2 C346.2 C347.2 C348.2 C349.2 C350.2 C351.2 C352.2 C353.2 C354.2 C355.2 C356.2 C357.2 C358.2 C359.2 C360.2 C361.2 C362.2 C363.2 C364.2 C365.2 C367.2 C368.2 C369.2 C370.2 C371.2 C372.2 C373.2 C374.2 C375.2 C376.2 C377.2 C379.2 C380.2 C383.2 C384.2 C387.2 C388.2 C391.2 C392.2 C393.2 C394.2 C395.2 C396.1 C397.2 C398.2 C399.2 C400.2 C401.2 C402.2 C403.2 C404.2 C405.2 C406.2 C407.2 FB22.5(GND) FB22.6(GND) FB23.5(GND) FB23.6(GND) FB24.5(GND) FB24.6(GND) FB25.5(GND) FB25.6(GND) FB26.5(GND) FB26.6(GND) FB27.5(GND) FB27.6(GND) FB28.5(GND) FB28.6(GND) FB29.5(GND) FB29.6(GND) J9.4(GND) J9.7(GND) J10.4(GND) J10.7(GND) J11.4(GND) J11.7(GND) J12.4(GND) J12.7(GND) R267.2 R268.2 R269.2 R270.2 R271.2 R272.2 R273.2 R276.2 R278.2 R285.2 R286.2 R287.2 R335.2 U33.3(GND) U34.B20(VSS) U34.B32(JTAG_RST#) U34.PAD(VSS) U35.3(GND) U36.3(GND) U37.3(GND) U38.12(GND) U38.21(PAD) U39.1(GND) U39.11(PAD) U40.1(GND) U40.11(PAD)
AUX_DET: R266.2 R268.1 R269.1 U34.A52(AUX_DET)
CAP_DS_TX1_N: C366.2 FB23.1
CAP_DS_TX1_P: C378.2 FB23.2
CAP_DS_TX2_N: C381.2 FB25.1
CAP_DS_TX2_P: C382.2 FB25.2
CAP_DS_TX3_N: C385.2 FB27.1
CAP_DS_TX3_P: C386.2 FB27.2
CAP_DS_TX4_N: C389.2 FB29.1
CAP_DS_TX4_P: C390.2 FB29.2
GRSTZ: C393.1 R277.2 U34.A15(GRST#) U38.9(PG)
IND_DS_TX1_N: FB23.4 J9.8(SSTXN)
IND_DS_TX1_P: FB23.3 J9.9(SSTXP)
IND_DS_TX2_N: FB25.4 J10.8(SSTXN)
IND_DS_TX2_P: FB25.3 J10.9(SSTXP)
IND_DS_TX3_N: FB27.4 J11.8(SSTXN)
IND_DS_TX3_P: FB27.3 J11.9(SSTXP)
IND_DS_TX4_N: FB29.4 J12.8(SSTXN)
IND_DS_TX4_P: FB29.3 J12.9(SSTXP)
IND_USB_D_DN1_N: FB22.4 J9.2(DM)
IND_USB_D_DN1_P: FB22.3 J9.3(DP)
IND_USB_D_DN2_N: FB24.4 J10.2(DM)
IND_USB_D_DN2_P: FB24.3 J10.3(DP)
IND_USB_D_DN3_N: FB26.4 J11.2(DM)
IND_USB_D_DN3_P: FB26.3 J11.3(DP)
IND_USB_D_DN4_N: FB28.4 J12.2(DM)
IND_USB_D_DN4_P: FB28.3 J12.3(DP)
OVERCURRENTZ1: R281.2 U34.A36(OVERCUR1#) U39.6(FAULT2Z)
OVERCURRENTZ2: R282.2 U34.A37(OVERCUR2#) U40.10(FAULT1Z)
OVERCURRENTZ3: R280.2 U34.B43(OVERCUR3#) U39.10(FAULT1Z)
OVERCURRENTZ4: R283.2 U34.B45(OVERCUR4#) U40.6(FAULT2Z)
~{PERSTZ}: R288.1 ; port ~{PERSTZ}
PCIE_CLK_N: R323.1 ; port PCIE_CLKN
PCIE_CLK_P: R324.1 ; port PCIE_CLKP
PCIE_RX_N: C418.1 ; port PCIE_RXN
PCIE_RX_P: C419.1 ; port PCIE_RXP
PCIE_TX_N: R325.1 ; port PCIE_TXN
PCIE_TX_P: R326.1 ; port PCIE_TXP
PCIECLK_N: R323.2 U34.B41(PCIE_REFCLKN)
PCIECLK_P: R324.2 U34.A45(PCIE_REFCLKP)
PCIERX_N: C418.2 U34.A41(PCIE_TXN)
PCIERX_P: C419.2 U34.B38(PCIE_TXP)
PCIETX_N: R325.2 U34.A42(PCIE_RXN)
PCIETX_P: R326.2 U34.B39(PCIE_RXP)
PERST#: R288.2 U34.A40(PERST#)
PWRON1: U34.B33(PWRON1#) U39.5(EN2)
PWRON2: U34.B34(PWRON2#) U40.4(EN1)
PWRON3: U34.A46(PWRON3#) U39.4(EN1)
PWRON4: U34.A48(PWRON4#) U40.5(EN2)
USB_D_DN1_N: FB22.1 U34.B18(USB_DM_DN1)
USB_D_DN1_P: FB22.2 U34.A20(USB_DP_DN1)
USB_D_DN2_N: FB24.1 U34.A13(USB_DM_DN2)
USB_D_DN2_P: FB24.2 U34.B12(USB_DP_DN2)
USB_D_DN3_N: FB26.1 U34.A27(USB_DM_DN3)
USB_D_DN3_P: FB26.2 U34.B25(USB_DP_DN3)
USB_D_DN4_N: FB28.1 U34.A5(USB_DM_DN4)
USB_D_DN4_P: FB28.2 U34.B5(USB_DP_DN4)
USB_SSRX_DN1_N: J9.5(SSRXN) U33.2(D-) U34.B16(USB_SSRXN_DN1)
USB_SSRX_DN1_P: J9.6(SSRXP) U33.1(D+) U34.A18(USB_SSRXP_DN1)
USB_SSRX_DN2_N: J10.5(SSRXN) U34.A10(USB_SSRXN_DN2) U35.2(D-)
USB_SSRX_DN2_P: J10.6(SSRXP) U34.B9(USB_SSRXP_DN2) U35.1(D+)
USB_SSRX_DN3_N: J11.5(SSRXN) U34.A29(USB_SSRXN_DN) U36.2(D-)
USB_SSRX_DN3_P: J11.6(SSRXP) U34.B27(USB_SSRXP_DN3) U36.1(D+)
USB_SSRX_DN4_N: J12.5(SSRXN) U34.A7(USB_SSRXN_DN4) U37.2(D-)
USB_SSRX_DN4_P: J12.6(SSRXP) U34.B6(USB_SSRXP_DN4) U37.1(D+)
USB_SSTX_DN1_N: C366.1 U34.B15(USB_SSTXN_DN1)
USB_SSTX_DN1_P: C378.1 U34.A17(USB_SSTXP_DN1)
USB_SSTX_DN2_N: C381.1 U34.B10(USB_SSTXN_DN2)
USB_SSTX_DN2_P: C382.1 U34.A11(USB_SSTXP_DN2)
USB_SSTX_DN3_N: C385.1 U34.A30(USB_SSTXN_DN3)
USB_SSTX_DN3_P: C386.1 U34.B28(USB_SSTXP_DN3)
USB_SSTX_DN4_N: C389.1 U34.A8(USB_SSTXN_DN4)
USB_SSTX_DN4_P: C390.1 U34.B7(USB_SSTXP_DN4)
~{WAKEZ}: R289.1 ; port ~{WAKEZ}
WAKE#: R289.2 U34.B35(WAKE#)
NetC379_1: C379.1 C380.1 J9.10(SHIELD0) J9.11(SHIELD1) R267.1
NetC383_1: C383.1 C384.1 J10.10(SHIELD0) J10.11(SHIELD1) R272.1
NetC387_1: C387.1 C388.1 J11.10(SHIELD0) J11.11(SHIELD1) R273.1
NetC391_1: C391.1 C392.1 J12.10(SHIELD0) J12.11(SHIELD1) R278.1
NetC398_1: C398.1 R279.2 U38.11(EN)
NetC399_1: C399.1 U38.15(SS)
NetC408_1: C408.1 C409.2 U34.B21(VSS_OSC)
NetC408_2: C408.2 R275.1 U34.A22(XO) Y6.1
NetC409_1: C409.1 R275.2 U34.A23(XI) Y6.3
NetR270_1: R270.1 U34.B2(SCL)
NetR271_1: R271.1 U34.A2(SDA)
NetR274_1: R274.1 U34.B23(R1EXTRTN)
NetR274_2: R274.2 U34.A24(R1EXT)
NetR276_1: R276.1 U34.B14(FREQSEL)
NetR284_2: R284.2 R285.1 U38.16(FB/SNS)
NetR286_1: R286.1 U39.7(ILIM)
NetR287_1: R287.1 U40.7(ILIM)
NetR304_2: R304.2 U34.B8(NC)
NetR335_1: R335.1 Y6.2 Y6.4

Not connected (* = marked no-connect by the designer): U34 A14(NC)* A26(NC)* A32(JTAG_TCK)* A35(JTAG_TDI)* A43(NC)* A49(GPIO0)* B3(SMI)* B13(NC)* B29(NC)* B30(JTAG_TMS)* B31(JTAG_TDO)* B36(CLKREQ#)* B46(GPIO1)* B47(GPIO2)* B48(GPIO3)*; U38 2(NC)* 3(NC)* 4(NC)* 13(NC)* 14(NC)* 17(NC)*

### Layout directives
net class USB 90ohm; Impedance: 90 Ω: CAP_DS_TX1_N, CAP_DS_TX1_P, CAP_DS_TX2_N, CAP_DS_TX2_P, CAP_DS_TX3_N, CAP_DS_TX3_P, CAP_DS_TX4_N, CAP_DS_TX4_P, IND_DS_TX1_N, IND_DS_TX1_P, IND_DS_TX2_N, IND_DS_TX2_P, IND_DS_TX3_N, IND_DS_TX3_P, IND_DS_TX4_N, IND_DS_TX4_P, IND_USB_D_DN1_N, IND_USB_D_DN1_P, IND_USB_D_DN2_N, IND_USB_D_DN2_P, IND_USB_D_DN3_N, IND_USB_D_DN3_P, IND_USB_D_DN4_N, IND_USB_D_DN4_P, USB_D_DN1_N, USB_D_DN1_P, USB_D_DN2_N, USB_D_DN2_P, USB_D_DN3_N, USB_D_DN3_P, USB_D_DN4_N, USB_D_DN4_P, USB_SSRX_DN1_N, USB_SSRX_DN1_P, USB_SSRX_DN2_N, USB_SSRX_DN2_P, USB_SSRX_DN3_N, USB_SSRX_DN3_P, USB_SSRX_DN4_N, USB_SSRX_DN4_P, USB_SSTX_DN1_N, USB_SSTX_DN1_P, USB_SSTX_DN2_N, USB_SSTX_DN2_P, USB_SSTX_DN3_N, USB_SSTX_DN3_P, USB_SSTX_DN4_N, USB_SSTX_DN4_P
differential pair: CAP_DS_TX1_N, CAP_DS_TX1_P, CAP_DS_TX2_N, CAP_DS_TX2_P, CAP_DS_TX3_N, CAP_DS_TX3_P, CAP_DS_TX4_N, CAP_DS_TX4_P, IND_DS_TX1_N, IND_DS_TX1_P, IND_DS_TX2_N, IND_DS_TX2_P, IND_DS_TX3_N, IND_DS_TX3_P, IND_DS_TX4_N, IND_DS_TX4_P, IND_USB_D_DN1_N, IND_USB_D_DN1_P, IND_USB_D_DN2_N, IND_USB_D_DN2_P, IND_USB_D_DN3_N, IND_USB_D_DN3_P, IND_USB_D_DN4_N, IND_USB_D_DN4_P, PCIE_CLK_N, PCIE_CLK_P, PCIE_RX_N, PCIE_RX_P, PCIE_TX_N, PCIE_TX_P, PCIECLK_N, PCIECLK_P, PCIERX_N, PCIERX_P, PCIETX_N, PCIETX_P, USB_D_DN1_N, USB_D_DN1_P, USB_D_DN2_N, USB_D_DN2_P, USB_D_DN3_N, USB_D_DN3_P, USB_D_DN4_N, USB_D_DN4_P, USB_SSRX_DN1_N, USB_SSRX_DN1_P, USB_SSRX_DN2_N, USB_SSRX_DN2_P, USB_SSRX_DN3_N, USB_SSRX_DN3_P, USB_SSRX_DN4_N, USB_SSRX_DN4_P, USB_SSTX_DN1_N, USB_SSTX_DN1_P, USB_SSTX_DN2_N, USB_SSTX_DN2_P, USB_SSTX_DN3_N, USB_SSTX_DN3_P, USB_SSTX_DN4_N, USB_SSTX_DN4_P
net class PCIE 100ohm: PCIE_CLK_N, PCIE_CLK_P, PCIE_RX_N, PCIE_RX_P, PCIE_TX_N, PCIE_TX_P, PCIECLK_N, PCIECLK_P, PCIERX_N, PCIERX_P, PCIETX_N, PCIETX_P

### Notes on the sheet
- (near U34) No I2C EEPROM, Use Default config
- First View Consultants
- Austin, Tx
- 512.582.9102
- firstviewconsultants.com
- Title:
- File:
- Drawn:
- Sheet
- of
- FVC #:
- Checked:
- Approved:
- Date:
- Page Size:
- C
- Rev.
- Time:

### Library data of the parts
C341-C343 C354-C358 C367-C371 C398 C399 = Cap 0.01uF 50V 0402: as C314 on sheet 15 USB; Tolerance: ±10%; Package: 0402
  C399: DNP: DNP
C344-C348 C350-C353 C359-C364 C366 C372-C378 C380-C382 C384-C386 C388-C390 C392 C393 C395 C396 C400 C402 C404 C406 C418 C419 = Cap 0.1uF 16V 0402: as C309-C313 on sheet 15 USB; Package: 0402; Tolerance: ±10%
C349 C365 C397 = Cap 22uF 6.3V 0603: Cap, Cer, 22uF, 6.3V, 20%, X5R, 0603; Manufacturer: Murata Electronics North America; Manufacturer #: GRM188R60J226MEA0D; Tolerance: ±10%; Package: 0603; Temperature Coefficient: X5R; Cost: $0.27
C379 C383 C387 C391 = Cap 1000pF 50V 0402: as C308 on sheet 15 USB; Tolerance: 20%; PACKAGE: 0402
C394 = Cap 10uF 6.3V 0402: Cap, Cer, 10uF, 6.3V, 20%, X5R, 0402; Manufacturer #: CL05A106MQ5NUNC; Manufacturer: Samsung Electro-Mechanics America, Inc; Have Footprint: yes; RoHS: yes; Tolerance: ±20%; Operating Temperature: -55°C ~ 85°C; Package: 0402
C401 C403 C405 C407 = Cap 150uF 10V: Cap, Alum, 150µF, 10V, 20%, SMD; Manufacturer #: WT1A151MCL1GS; Manufacturer: Nichicon; Tolerance: 20%; Package: SMD (6.6x6.6x5.8); Operating Temperature: -55°C ~ 105°C
C408 C409 = Cap 18pF 50V 0402: Cap, Cer, 18pF, 50V, 5%, C0G, 0402; Manufacturer #: C1005C0G1H180J050BA; Manufacturer: TDK Corporation; Have Footprint: yes; Package: 0402
FB21 = BLM18KG101TN1D: Ind, Ferrite Bead, 100R, 30mOhm, 3A, 0603; Manufacturer: Murata Electronics North America; Have Footprint: yes; RoHS: yes; Package: 0603; Manufacturer #: BLM18KG101TN1D
FB22-FB29 = TCE1210U-120-2P: Choke, Common Mode, 12 ohm, SMD; Manufacturer: TDK Corporation; Cost: 1.73; Manufacturer #: TCE1210U-120-2P; Package: SMD(1.25x1)
J9-J12 = E8199-001-01: Conn, USB 3.0, TYPE A RCPT, TH; Manufacturer: Pulse Electronics Corporation; Have Footprint: yes; Manufacturer #: E8199-001-01; Cost: 0.73; Package: TH
R266 R277 R280-R283 = Res 10K 0.063W: as R230 on sheet 15 USB; Package: 0402
R267 R272 R273 R275 R278 = Res 1M 0.063W: Res, 1M, 0.063W, 1%, 0402; Manufacturer #: RC0402FR-071ML; Manufacturer: Yageo; Have Footprint: yes; Package: 0402
R268 R304 = Res 0 ohm 0.1W DNP: Res, 0 ohm, 1/16W, 0402; Manufacturer #: CRCW04020000Z0ED; Manufacturer: Vishay Dale; Have Footprint: yes; Package: 0402; DNP: DNP
R269-R271 R288 R289 R323-R326 R335 = Res 0 ohm 0.1W: as R264 on sheet 16 Ethernet; Package: 0402
R274 = Res 9.09K 0.063W: Res, 9.09K, 0.063W, 1%, 0402; Manufacturer #: RMCF0402FT9K09; Manufacturer: Stackpole Electronics Inc; Have Footprint: yes; Package: 0402
R276 R279 = Res 4.7K 0.063W: as R241 on sheet 15 USB; Package: 0402
R284 = Res 1.87K 0.063W: Res, 1.87K, 0.063W, 1%, 0402; Manufacturer #: RMCF0402FT1K87; Manufacturer: Stackpole Electronics Inc; Have Footprint: yes; Package: 0402; Tolerance: 1%
R285 = Res 4.99K 0.063W: Res, 4.99K, 0.063W, 1%, 0402; Manufacturer #: RC1005F4991CS; Manufacturer: Samsung Electro-Mechanics America, Inc; Have Footprint: yes; Package: 0402
R286 R287 = Res 30.9K 0.063W: Res, 30.9K, 0.063W, 1%, 0402; Manufacturer #: RMCF0402FT30K9; Manufacturer: Stackpole Electronics Inc; Have Footprint: yes; Package: 0402
U33 U35-U37 = TPD2EUSB30ADRTR: Diode, TVS, 3.6VWM, 8VC, SOT-3; Manufacturer: Texas Instruments; Cost: 0.61; Manufacturer #: TPD2EUSB30ADRTR
U34 = TUSB7340IRKMT: IC, 4-PORT USB 3.0 xHCI Host HUB, WQFN-100; Manufacturer: Texas Instruments; Cost: 11.14; Manufacturer #: TUSB7340IRKMT; Package: WQFN-100
U38 = TPS74401RGWT: LDO, Adj., 3A, VQFN-20; Manufacturer: Texas Instruments; Have Footprint: yes; Cost: 7.20; Manufacturer #: TPS74401RGWT; Package: VQFN-20
U39 = TPS2560DRC: IC, Power Dist Switch, Adj., VSON-10; Manufacturer: Texas Instruments; Have Footprint: yes; Cost: 3.02; Manufacturer #: TPS2560DRCT; Package: VSON-10
U40 = TPS2560DRCT: IC, Power Dist Switch, Adj., VSON-10; Manufacturer: Texas Instruments; Have Footprint: yes; Cost: 3.02; Manufacturer #: TPS2560DRCT; Package: VSON-10
Y6 = ABM3B-48.000MHZ-B2-T: Clock, Crystal, 48 MHz, 18pF, SMD; Manufacturer: Abracon LLC; Cost: 1.04; Manufacturer #: ABM3B-48.000MHZ-B2-T; Package: SMD(5x3.2)

## Nets that join several sheets
1V5SW: 5 Power Supplies (5 pins), 11 Camera Input (C222.1 C230.1 FB5.2 FB7.2)
1V8SW: 5 Power Supplies (5 pins), 6 Bluetooth (FB15.2), 7 WiFi (C131.1 FB17.2)
3V3SW: 3 MXM Connector 2 (6 pins), 4 Connectors (13 pins), 5 Power Supplies (17 pins), 6 Bluetooth (FB14.1 R35.1), 7 WiFi (C125.1 FB16.1), 8 GPS (8 pins), 9 Microphone Input (C160.1 C161.1 R79.1 U6.10), 10 Audio Out (FB1.1 FB2.1 R92.1), 11 Camera Input (9 pins), 12 CAN, ADC, DAC (9 pins), 13 LCD Backlight, Touchscreen (8 pins), 14 LCD Power Supply (R336.2), 15 USB (7 pins), 17 USB 3.0 (24 pins)
5VSW: 2 MXM Connector 1 (8 pins), 3 MXM Connector 2 (8 pins), 5 Power Supplies (9 pins), 8 GPS (C329.1 U31.6), 9 Microphone Input (R56.1), 10 Audio Out (R84.1), 11 Camera Input (12 pins), 12 CAN, ADC, DAC (C245.1 U21.3), 15 USB (C309.1 C311.1 U9.5 U17.5), 17 USB 3.0 (6 pins)
8V5SW: 5 Power Supplies (5 pins), 9 Microphone Input (R71.2 R72.2 R73.2 R74.2)
AVDD: 4 Connectors (C79.1 C80.1 J14.62 J14.63), 14 LCD Power Supply (5 pins)
BATTERY: 4 Connectors (C50.1 J1.4), 5 Power Supplies (J13.1 R309.1 SW6.1 TP7.1)
BGND: 4 Connectors (C50.2 J1.5 J1.7), 5 Power Supplies (5 pins)
FBATT: 5 Power Supplies (32 pins), 12 CAN, ADC, DAC (R243.1), 13 LCD Backlight, Touchscreen (D6.A), 14 LCD Power Supply (C422.1 FB31.1)
GND: 2 MXM Connector 1 (50 pins), 3 MXM Connector 2 (56 pins), 4 Connectors (79 pins), 5 Power Supplies (75 pins), 6 Bluetooth (21 pins), 7 WiFi (38 pins), 8 GPS (31 pins), 9 Microphone Input (23 pins), 10 Audio Out (15 pins), 11 Camera Input (68 pins), 12 CAN, ADC, DAC (24 pins), 13 LCD Backlight, Touchscreen (31 pins), 14 LCD Power Supply (55 pins), 15 USB (32 pins), 16 Ethernet (6 pins), 17 USB 3.0 (109 pins)
HALF_SUPP: 9 Microphone Input (7 pins), 10 Audio Out (U14.3 U14.5)
VCOM: 4 Connectors (C75.1 C76.1 J14.68), 14 LCD Power Supply (C301.1 Q8.3 R220.1 TP13.1)
VDD: 4 Connectors (C64.1 C65.1 FB30.1), 14 LCD Power Supply (C275.1 FB10.2 R336.1 TP4.1)
VGH: 4 Connectors (C78.1 J14.65), 14 LCD Power Supply (C289.1 Q5.3 R205.2 TP11.1)
VGL: 4 Connectors (C77.1 J14.67), 14 LCD Power Supply (5 pins)
ADC_DAC_SPI_CLK: 2 MXM Connector 1 (J7.231), 12 CAN, ADC, DAC (R153.1)
ADC_DAC_SPI_MISO: 2 MXM Connector 1 (J7.215), 12 CAN, ADC, DAC (R151.2)
ADC_DAC_SPI_MOSI: 2 MXM Connector 1 (J7.221), 12 CAN, ADC, DAC (R152.1)
ADC_EOC: 2 MXM Connector 1 (C31.1 J7.219), 12 CAN, ADC, DAC (U19.19)
ADC_SPI_SS: 2 MXM Connector 1 (C37.1 J7.227), 12 CAN, ADC, DAC (U19.15)
APP_RESET: 3 MXM Connector 2 (C15.1 J7.234), 11 Camera Input (U32.7)
BT_ENABLE: 3 MXM Connector 2 (C16.1 J7.174), 6 Bluetooth (R33.1)
BT_I2S_CLK: 2 MXM Connector 1 (J7.141), 6 Bluetooth (U2.23)
BT_I2S_SDI: 2 MXM Connector 1 (J7.145), 6 Bluetooth (U2.25)
BT_I2S_SDO: 2 MXM Connector 1 (J7.153), 6 Bluetooth (U2.26)
BT_I2S_WS: 2 MXM Connector 1 (J7.149), 6 Bluetooth (U2.24)
BT_RESET: 3 MXM Connector 2 (C18.1 J7.176), 6 Bluetooth (C114.1 R36.1 U2.11)
BT_UART_CTS: 3 MXM Connector 2 (J7.36), 6 Bluetooth (R293.1 R297.1)
BT_UART_RTS: 3 MXM Connector 2 (J7.48), 6 Bluetooth (R292.1 R296.1)
BT_UART_RX: 3 MXM Connector 2 (J7.186), 6 Bluetooth (R291.1 R295.1)
BT_UART_TX: 3 MXM Connector 2 (J7.180), 6 Bluetooth (R290.1 R294.1)
CAM1_N: 4 Connectors (C68.1 J3.2), 11 Camera Input (C207.1)
CAM1_P: 4 Connectors (C67.1 J3.1), 11 Camera Input (C203.1)
CAM2_N: 4 Connectors (C69.1 J3.4), 11 Camera Input (C208.1)
CAM2_P: 4 Connectors (C74.1 J3.3), 11 Camera Input (C204.1)
CAM3_N: 4 Connectors (C71.1 J3.6), 11 Camera Input (C209.1)
CAM3_P: 4 Connectors (C70.1 J3.5), 11 Camera Input (C205.1)
CAM4_N: 4 Connectors (C73.1 J3.8), 11 Camera Input (C210.1)
CAM4_P: 4 Connectors (C72.1 J3.7), 11 Camera Input (C206.1)
CAM_APP_I2C_CLK: 3 MXM Connector 2 (J7.244), 11 Camera Input (R141.2 R148.2)
CAM_APP_I2C_DATA: 3 MXM Connector 2 (J7.242), 11 Camera Input (R142.2 R145.2)
CAM_CLK: 2 MXM Connector 1 (J7.15), 11 Camera Input (R139.2)
CAM_DATA_A0: 2 MXM Connector 1 (J7.115), 11 Camera Input (R127.2)
CAM_DATA_A1: 2 MXM Connector 1 (J7.117), 11 Camera Input (R128.2)
CAM_DATA_A2: 2 MXM Connector 1 (J7.137), 11 Camera Input (R130.2)
CAM_DATA_A3: 2 MXM Connector 1 (J7.135), 11 Camera Input (R131.2)
CAM_DATA_A4: 2 MXM Connector 1 (J7.119), 11 Camera Input (R132.2)
CAM_DATA_A5: 2 MXM Connector 1 (J7.121), 11 Camera Input (R133.2)
CAM_DATA_A6: 2 MXM Connector 1 (J7.125), 11 Camera Input (R134.2)
CAM_DATA_A7: 2 MXM Connector 1 (J7.133), 11 Camera Input (R135.2)
CAM_EN: 2 MXM Connector 1 (C36.1 J7.169), 11 Camera Input (R143.2 U10.14)
CAM_HSYNC: 2 MXM Connector 1 (J7.17), 11 Camera Input (R137.2)
CAM_VSYNC: 2 MXM Connector 1 (J7.31), 11 Camera Input (R138.2)
CAN_N: 4 Connectors (J2.6), 12 CAN, ADC, DAC (C316.1 J17.2 R157.2 U21.6)
CAN_P: 4 Connectors (J2.8), 12 CAN, ADC, DAC (C248.1 J17.1 R154.1 U21.7)
CAN_RX: 2 MXM Connector 1 (J7.99), 12 CAN, ADC, DAC (R156.1 R303.1)
CAN_SLP: 2 MXM Connector 1 (C30.1 J7.103), 12 CAN, ADC, DAC (U21.8)
CAN_TX: 2 MXM Connector 1 (J7.101), 12 CAN, ADC, DAC (R155.1 R302.1)
COEX_0: 6 Bluetooth (R37.2), 7 WiFi (U3.34)
COEX_1: 6 Bluetooth (R38.2), 7 WiFi (U3.40)
COEX_2: 6 Bluetooth (R39.2), 7 WiFi (U3.39)
COEX_3: 6 Bluetooth (R40.2), 7 WiFi (U3.38)
COEX_4: 6 Bluetooth (R41.2), 7 WiFi (U3.36)
COEX_5: 6 Bluetooth (R42.2), 7 WiFi (U3.35)
DAC_SYNC: 2 MXM Connector 1 (C39.1 J7.229), 12 CAN, ADC, DAC (R150.2 U25.6)
DEBUG_UART_RX: 2 MXM Connector 1 (J7.147), 15 USB (U30.3)
DEBUG_UART_TX: 2 MXM Connector 1 (J7.143), 15 USB (U30.6)
DISP_RESET: 2 MXM Connector 1 (C29.1 J7.213), 4 Connectors (C57.1 J14.18 R7.1)
GPS_ANT_EN: 3 MXM Connector 2 (C11.1 J7.220), 8 GPS (R261.2 U31.4)
GPS_ANT_FAULT: 3 MXM Connector 2 (C13.1 J7.222), 8 GPS (R260.2 U31.3)
GPS_RESET: 3 MXM Connector 2 (C6.1 J7.76), 8 GPS (U15.17)
GPS_SFBOOT: 3 MXM Connector 2 (C14.1 J7.172), 8 GPS (R55.2 U15.34)
GPS_UART_RX: 2 MXM Connector 1 (J7.23), 8 GPS (R298.2 R301.2)
GPS_UART_TX: 2 MXM Connector 1 (J7.25), 8 GPS (R299.2 R300.2)
I2S_MCLK: 2 MXM Connector 1 (J7.151), 9 Microphone Input (R83.1)
LCD_LED_EN_PWM: 2 MXM Connector 1 (C38.1 J7.171), 13 LCD Backlight, Touchscreen (U24.7)
LCD_LED_FAULT: 2 MXM Connector 1 (C34.1 J7.167), 13 LCD Backlight, Touchscreen (R159.2 U24.4)
LCD_LVDS_TX0_N: 2 MXM Connector 1 (J7.E3-4), 4 Connectors (J14.32)
LCD_LVDS_TX0_P: 2 MXM Connector 1 (J7.E3-3), 4 Connectors (J14.31)
LCD_LVDS_TX1_N: 2 MXM Connector 1 (J7.E3-1), 4 Connectors (J14.35)
LCD_LVDS_TX1_P: 2 MXM Connector 1 (J7.E1-10), 4 Connectors (J14.34)
LCD_LVDS_TX2_N: 2 MXM Connector 1 (J7.E3-9), 4 Connectors (J14.38)
LCD_LVDS_TX2_P: 2 MXM Connector 1 (J7.E3-10), 4 Connectors (J14.37)
LCD_LVDS_TX3_N: 2 MXM Connector 1 (J7.5), 4 Connectors (J14.41)
LCD_LVDS_TX3_P: 2 MXM Connector 1 (J7.3), 4 Connectors (J14.40)
LCD_LVDS_TXCLK_N: 2 MXM Connector 1 (J7.E3-7), 4 Connectors (J14.29)
LCD_LVDS_TXCLK_P: 2 MXM Connector 1 (J7.E3-6), 4 Connectors (J14.28)
LCD_PWR_ENABLE: 2 MXM Connector 1 (C33.1 J7.223), 14 LCD Power Supply (R181.1 U27.30)
LCD_PWR_RESET: 2 MXM Connector 1 (C35.1 J7.225), 14 LCD Power Supply (C277.1 U27.12)
MIC1+: 4 Connectors (C61.1 J2.3), 9 Microphone Input (C156.1 J15.4 R71.1 R72.1)
MIC1-: 4 Connectors (C60.1 J2.1), 9 Microphone Input (C154.1 J15.1 R61.2 R62.2)
MIC2+: 4 Connectors (C63.1 J2.4), 9 Microphone Input (C157.1 J15.2 R73.1 R74.1)
MIC2-: 4 Connectors (C62.1 J2.2), 9 Microphone Input (C155.1 J15.3 R63.2 R64.2)
MIC_I2S_BCLK: 3 MXM Connector 2 (J7.80), 9 Microphone Input (R77.1)
MIC_I2S_DATA: 3 MXM Connector 2 (J7.88), 9 Microphone Input (C165.1 R81.2)
MIC_I2S_LRCLK: 3 MXM Connector 2 (J7.78), 9 Microphone Input (R78.1)
MIC_I2S_MCLK: 3 MXM Connector 2 (J7.86), 9 Microphone Input (R80.1)
NetC42_1: 4 Connectors (C42.1 J14.7 J14.8), 13 LCD Backlight, Touchscreen (FB9.2)
NetC43_1: 4 Connectors (C43.1 J14.5), 13 LCD Backlight, Touchscreen (U24.14)
NetC44_1: 4 Connectors (C44.1 J14.4), 13 LCD Backlight, Touchscreen (U24.13)
NetC45_1: 4 Connectors (C45.1 R5.1), 12 CAN, ADC, DAC (U19.2)
NetC47_1: 4 Connectors (C47.1 J1.1), 10 Audio Out (C186.2 J16.3)
NetC48_1: 4 Connectors (C48.1 J1.3), 10 Audio Out (C182.2 J16.2)
NetC51_1: 3 MXM Connector 2 (R2.2 R3.2), 4 Connectors (C51.1 J1.6)
NetC53_1: 4 Connectors (C53.1 J14.10), 13 LCD Backlight, Touchscreen (R332.1)
NetC54_1: 4 Connectors (C54.1 J14.12), 13 LCD Backlight, Touchscreen (R331.1)
NetC55_1: 4 Connectors (C55.1 J14.14), 13 LCD Backlight, Touchscreen (R334.1)
NetC56_1: 4 Connectors (C56.1 J14.16), 13 LCD Backlight, Touchscreen (R333.1)
NetC265_1: 4 Connectors (J14.60), 14 LCD Power Supply (C265.1 R171.2 R173.1)
NetC266_1: 4 Connectors (J14.59), 14 LCD Power Supply (C266.1 R173.2 R174.1)
NetC267_1: 4 Connectors (J14.58), 14 LCD Power Supply (C267.1 R174.2 R175.1)
NetC270_1: 4 Connectors (J14.57), 14 LCD Power Supply (C270.1 R175.2 R177.1)
NetC273_1: 4 Connectors (J14.56), 14 LCD Power Supply (C273.1 R177.2 R180.1)
NetC274_1: 4 Connectors (J14.55), 14 LCD Power Supply (C274.1 R180.2 R184.1)
NetC278_1: 4 Connectors (J14.54), 14 LCD Power Supply (C278.1 R184.2 R188.1)
NetC279_1: 4 Connectors (J14.53), 14 LCD Power Supply (C279.1 R188.2 R192.1)
NetC281_1: 4 Connectors (J14.52), 14 LCD Power Supply (C281.1 R192.2 R195.1)
NetC283_1: 4 Connectors (J14.51), 14 LCD Power Supply (C283.1 R195.2 R200.1)
NetC288_1: 4 Connectors (J14.50), 14 LCD Power Supply (C288.1 R200.2 R204.1)
NetC290_1: 4 Connectors (J14.49), 14 LCD Power Supply (C290.1 R204.2 R209.1)
NetC293_1: 4 Connectors (J14.48), 14 LCD Power Supply (C293.1 R209.2 R215.1)
NetC297_1: 4 Connectors (J14.47), 14 LCD Power Supply (C297.1 R215.2 R219.1)
NetC300_1: 4 Connectors (J14.46), 14 LCD Power Supply (C300.1 R219.2 R225.1)
NetC304_1: 4 Connectors (J14.45), 14 LCD Power Supply (C304.1 R225.2 R226.1)
NetC306_1: 4 Connectors (J14.44), 14 LCD Power Supply (C306.1 R226.2 R227.1)
NetC307_1: 4 Connectors (J14.43), 14 LCD Power Supply (C307.1 R227.2 R228.1)
NetJ7_258: 3 MXM Connector 2 (J7.258), 16 Ethernet (R257.1)
NetJ7_260: 3 MXM Connector 2 (J7.260), 16 Ethernet (R258.1)
NetR222_2: 12 CAN, ADC, DAC (U25.1), 14 LCD Power Supply (R222.2)
~{PERSTZ}: 3 MXM Connector 2 (J7.4), 17 USB 3.0 (R288.1)
PCIE_CLK_N: 3 MXM Connector 2 (J7.E4-3), 17 USB 3.0 (R323.1)
PCIE_CLK_P: 3 MXM Connector 2 (J7.E4-4), 17 USB 3.0 (R324.1)
PCIE_RX_N: 3 MXM Connector 2 (J7.E4-9), 17 USB 3.0 (C418.1)
PCIE_RX_P: 3 MXM Connector 2 (J7.E4-10), 17 USB 3.0 (C419.1)
PCIE_TX_N: 3 MXM Connector 2 (J7.E4-6), 17 USB 3.0 (R325.1)
PCIE_TX_P: 3 MXM Connector 2 (J7.E4-7), 17 USB 3.0 (R326.1)
POR: 2 MXM Connector 1 (C41.1 R328.1), 5 Power Supplies (R319.1)
RAUX_I2S_BCLK: 2 MXM Connector 1 (J7.157), 10 Audio Out (R87.1)
RAUX_I2S_DATA: 2 MXM Connector 1 (J7.163), 10 Audio Out (R90.1)
RAUX_I2S_WS: 2 MXM Connector 1 (J7.159), 10 Audio Out (R88.1)
RAUX_MUTE: 2 MXM Connector 1 (C32.1 J7.161), 10 Audio Out (R92.2 U16.8)
SD_CD: 3 MXM Connector 2 (C2.1 J7.178), 4 Connectors (R256.2 SD1.9)
SD_CLK: 3 MXM Connector 2 (J7.148), 4 Connectors (R253.2 SD1.5)
SD_CMD: 3 MXM Connector 2 (J7.150), 4 Connectors (R252.2 SD1.3)
SD_DATA0: 3 MXM Connector 2 (J7.138), 4 Connectors (R254.2 SD1.7)
SD_DATA1: 3 MXM Connector 2 (J7.154), 4 Connectors (R255.2 SD1.8)
SD_DATA2: 3 MXM Connector 2 (J7.140), 4 Connectors (R250.2 SD1.1)
SD_DATA3: 3 MXM Connector 2 (J7.146), 4 Connectors (R251.2 SD1.2)
SUPPLY_EN: 3 MXM Connector 2 (C5.1 J7.182), 5 Power Supplies (5 pins)
TOUCH_I2C_CLK: 3 MXM Connector 2 (C19.1 J7.248), 13 LCD Backlight, Touchscreen (R169.1 U26.2)
TOUCH_I2C_DATA: 3 MXM Connector 2 (C17.1 J7.246), 13 LCD Backlight, Touchscreen (R167.1 U26.1)
TOUCH_IRQ: 3 MXM Connector 2 (C12.1 J7.166), 13 LCD Backlight, Touchscreen (R166.1 U26.4)
TOUCH_RESET: 3 MXM Connector 2 (C9.1 J7.190), 13 LCD Backlight, Touchscreen (C263.1 R168.1 U26.5)
TRD1_N: 3 MXM Connector 2 (J7.274), 16 Ethernet (J8.10)
TRD1_P: 3 MXM Connector 2 (J7.272), 16 Ethernet (J8.11)
TRD2_N: 3 MXM Connector 2 (J7.270), 16 Ethernet (J8.5)
TRD2_P: 3 MXM Connector 2 (J7.268), 16 Ethernet (J8.4)
TRD3_N: 3 MXM Connector 2 (J7.264), 16 Ethernet (J8.2)
TRD3_P: 3 MXM Connector 2 (J7.262), 16 Ethernet (J8.3)
TRD4_N: 3 MXM Connector 2 (J7.240), 16 Ethernet (J8.9)
TRD4_P: 3 MXM Connector 2 (J7.238), 16 Ethernet (J8.8)
USB_DEA610_EN: 2 MXM Connector 1 (C27.1 J7.199), 15 USB (R232.1 U17.4)
USB_DEA610_FAULT: 2 MXM Connector 1 (C26.1 J7.91), 15 USB (R230.2 U17.3)
USB_DEA610_ID: 2 MXM Connector 1 (C25.1 J7.197), 15 USB (R231.1)
USB_DEA610_N: 2 MXM Connector 1 (J7.203), 15 USB (D13.1 J5.2)
USB_DEA610_P: 2 MXM Connector 1 (J7.201), 15 USB (D13.2 J5.3)
USB_DEA610_VBUS: 2 MXM Connector 1 (C40.1 J7.195), 15 USB (R229.1)
USB_HUB_EN: 2 MXM Connector 1 (C24.1 J7.29), 15 USB (R236.1 U9.4)
USB_HUB_FAULT: 2 MXM Connector 1 (C28.1 J7.93), 15 USB (R235.2 U9.3)
USB_HUB_N: 2 MXM Connector 1 (J7.189), 15 USB (D14.1 J6.2)
USB_HUB_P: 2 MXM Connector 1 (J7.191), 15 USB (D14.2 J6.3)
USB_HUB_VBUS: 3 MXM Connector 2 (C1.1 J7.32), 15 USB (R234.1)
VID_ENC_RST_N: 3 MXM Connector 2 (C4.1 J7.52), 11 Camera Input (C240.1 R147.1 U10.15)
~{WAKEZ}: 3 MXM Connector 2 (J7.6), 17 USB 3.0 (R289.1)
WIFI_RESET: 3 MXM Connector 2 (C8.1 J7.84), 7 WiFi (C129.1 R48.1 U3.41)
WIFI_SD_CLK: 3 MXM Connector 2 (J7.124), 7 WiFi (R50.1 R342.2)
WIFI_SD_CMD: 3 MXM Connector 2 (J7.116), 7 WiFi (R49.1 R341.2)
WIFI_SD_D0: 3 MXM Connector 2 (J7.114), 7 WiFi (R54.1 R346.2)
WIFI_SD_D1: 3 MXM Connector 2 (J7.112), 7 WiFi (R53.1 R345.2)
WIFI_SD_D2: 3 MXM Connector 2 (J7.106), 7 WiFi (R52.1 R344.2)
WIFI_SD_D3: 3 MXM Connector 2 (J7.108), 7 WiFi (R51.1 R343.2)
WIFI_VREG_EN: 3 MXM Connector 2 (C10.1 J7.90), 7 WiFi (C127.1 R43.1)